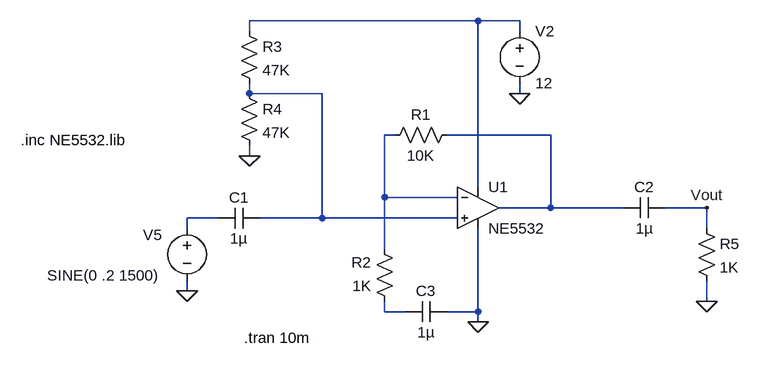
[diagram p0: schematic NE5532 Amplifier.asc]
NE5532 Amplifier.asc, the LTspice schematic file:
Version 4
SHEET 1 2540 788
WIRE 464 -80 112 -80
WIRE 528 -80 464 -80
WIRE 112 -64 112 -80
WIRE 528 -64 528 -80
WIRE 112 32 112 16
WIRE 224 32 112 32
WIRE 528 32 528 16
WIRE 336 96 320 96
WIRE 576 96 416 96
WIRE 112 128 112 112
WIRE 464 176 464 -80
WIRE 320 192 320 96
WIRE 432 192 320 192
WIRE 576 208 576 96
WIRE 576 208 496 208
WIRE 688 208 576 208
WIRE 816 208 752 208
WIRE 64 224 16 224
WIRE 224 224 224 32
WIRE 224 224 128 224
WIRE 432 224 224 224
WIRE 16 240 16 224
WIRE 816 240 816 208
WIRE 320 272 320 192
WIRE 16 336 16 320
WIRE 816 352 816 320
WIRE 320 368 320 352
WIRE 352 368 320 368
WIRE 464 368 464 240
WIRE 464 368 416 368
WIRE 464 384 464 368
FLAG 464 384 0
FLAG 528 32 0
FLAG 816 208 Vout
FLAG 16 336 0
FLAG 112 128 0
FLAG 816 352 0
SYMBOL voltage 528 -80 R0
WINDOW 123 0 0 Left 2
WINDOW 39 0 0 Left 2
SYMATTR InstName V2
SYMATTR Value 12
SYMBOL Opamps\\opamp2 464 144 R0
SYMATTR InstName U1
SYMATTR Value NE5532
SYMATTR Value2 NE5532
SYMBOL voltage 16 224 R0
WINDOW 123 0 0 Left 2
WINDOW 39 0 0 Left 2
WINDOW 0 -68 26 Left 2
WINDOW 3 -215 88 Left 2
SYMATTR InstName V5
SYMATTR Value SINE(0 .2 1500)
SYMBOL res 432 80 R90
WINDOW 0 0 56 VBottom 2
WINDOW 3 32 56 VTop 2
SYMATTR InstName R1
SYMATTR Value 10K
SYMBOL res 336 368 R180
WINDOW 0 36 76 Left 2
WINDOW 3 36 40 Left 2
SYMATTR InstName R2
SYMATTR Value 1K
SYMBOL cap 128 208 R90
WINDOW 0 0 32 VBottom 2
WINDOW 3 32 32 VTop 2
SYMATTR InstName C1
SYMATTR Value 1µ
SYMBOL res 96 -80 R0
SYMATTR InstName R3
SYMATTR Value 47K
SYMBOL res 96 16 R0
SYMATTR InstName R4
SYMATTR Value 47K
SYMBOL cap 752 192 R90
WINDOW 0 0 32 VBottom 2
WINDOW 3 32 32 VTop 2
SYMATTR InstName C2
SYMATTR Value 1µ
SYMBOL res 800 224 R0
SYMATTR InstName R5
SYMATTR Value 1K
SYMBOL cap 416 352 R90
WINDOW 0 0 32 VBottom 2
WINDOW 3 32 32 VTop 2
SYMATTR InstName C3
SYMATTR Value 1µ
TEXT -240 104 Left 2 !.inc NE5532.lib
TEXT 104 408 Left 2 !.tran 10m

The netlist it stands for:
* NE5532 Amplifier.asc
V2 N001 0 12
XU1 N002 N003 N001 0 N004 NE5532 NE5532  ; pins In+ In- V+ V- OUT
V5 N005 0 SINE(0 .2 1500)
R1 N004 N003 10K
R2 N006 N003 1K
C1 N002 N005 1µ
R3 N001 N002 47K
R4 N002 0 47K
C2 Vout N004 1µ
R5 Vout 0 1K
C3 0 N006 1µ
.inc NE5532.lib
.tran 10m
.backanno
.end